# EAGLE design ESP8266_weather_station_v1.1 (EAGLE 9.5.2)
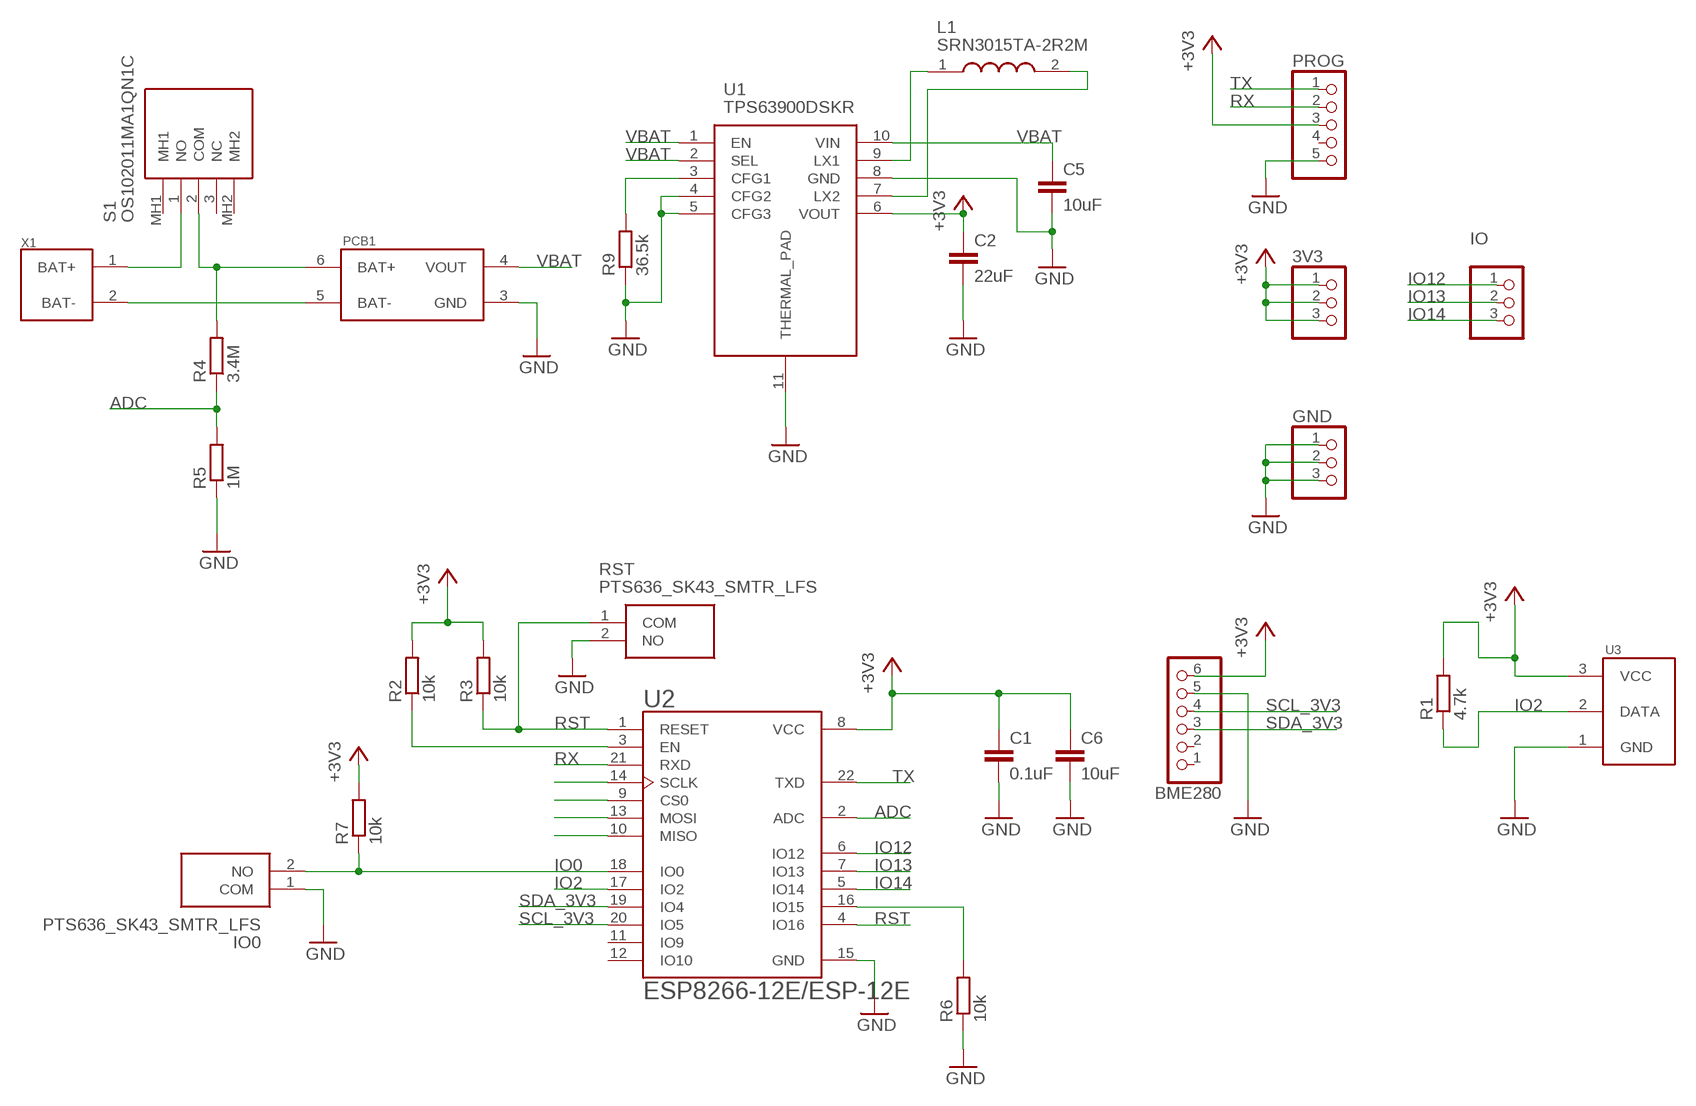
[diagram p0: schematic, sheet 1]

## Parts
3V3  PINHD-1X3  [1X03]
BME280  PINHD-1X6  [1X06]
C1  0.1uF  C-EUC0805  [C0805]
C2  22uF  C-EUC0805  [C0805]
C5  10uF  C-EUC0805  [C0805]
C6  10uF  C-EUC0805  [C0805]
GND  PINHD-1X3  [1X03]
IO  PINHD-1X3  [1X03]
IO0  PTS636_SK43_SMTR_LFS  [PTS636SK43SMTRLFS]
L1  SRN3015TA-2R2M  [SRN3015TA2R2M]
PCB1  TP4056_MODULE  [TP4056_MODULE]
PROG  PINHD-1X5  [1X05]
R1  4.7k  R-EU_R0805  [R0805]
R2  10k  R-EU_R0805  [R0805]
R3  10k  R-EU_R0805  [R0805]
R4  3.4M  R-EU_R0805  [R0805]
R5  1M  R-EU_R0805  [R0805]
R6  10k  R-EU_R0805  [R0805]
R7  10k  R-EU_R0805  [R0805]
R9  36.5k  R-EU_R0805  [R0805]
RST  PTS636_SK43_SMTR_LFS  [PTS636SK43SMTRLFS]
S1  OS102011MA1QN1C  [OS102011MA1QN1C]
U1  TPS63900DSKR  [SON50P250X250X80-11N]
U2  ESP8266-12E/ESP-12E  [XCVR_ESP8266-12E/ESP-12E]
U3  DS18B20  [DS18B20]
X1  18650_SMD_HOLDER  [18650_SMD_HOLDER]

## Nets
+3V3: 3V3.1 3V3.2 3V3.3 BME280.6 C1.1 C2.1 C6.1 PROG.3 R1.2 R2.2 R3.2 R7.2 U1.6(VOUT) U2.8(VCC) U3.3(VCC)
ADC: R4.1 R5.2 U2.2(ADC)
GND: BME280.5 C1.2 C2.2 C5.2 C6.2 GND.1 GND.2 GND.3 IO0.1(COM) PCB1.3(GND) PROG.5 R5.1 R6.1 R9.1 RST.2(NO) U1.4(CFG2) U1.5(CFG3) U1.8(GND) U1.11(THERMAL_PAD) U2.15(GND) U3.1(GND)
IO0: IO0.2(NO) R7.1 U2.18(IO0)
IO2: R1.1 U2.17(IO2) U3.2(DATA)
IO12: IO.1 U2.6(IO12)
IO13: IO.2 U2.7(IO13)
IO14: IO.3 U2.5(IO14)
N$1: S1.1(NO) X1.1(BAT+)
N$3: R9.2 U1.3(CFG1)
N$5: PCB1.6(BAT+) R4.2 S1.2(COM)
N$8: PCB1.5(BAT-) X1.2(BAT-)
N$9: R6.2 U2.16(IO15)
N$10: L1.1 U1.9(LX1)
N$11: L1.2 U1.7(LX2)
N$19: U2.10(MISO)
N$20: U2.13(MOSI)
N$21: U2.9(CS0)
N$22: U2.14(SCLK)
N$24: R2.1 U2.3(EN)
RST: R3.1 RST.1(COM) U2.1(RESET) U2.4(IO16)
RX: PROG.2 U2.21(RXD)
SCL_3V3: BME280.4 U2.20(IO5)
SDA_3V3: BME280.3 U2.19(IO4)
TX: PROG.1 U2.22(TXD)
VBAT: C5.1 PCB1.4(VOUT) U1.1(EN) U1.2(SEL) U1.10(VIN)
Unconnected: BME280.1 BME280.2 PROG.4 S1.3(NC) S1.MH1 S1.MH2 U2.11(IO9) U2.12(IO10)

## Library data of the parts
3V3 GND IO = pinhead:PINHD-1X3: PIN HEADER
BME280 = pinhead:PINHD-1X6: PIN HEADER
C1 C2 C5 C6 = resistor:C-EU: CAPACITOR, European symbol
IO0 RST = SamacSys_Parts:PTS636_SK43_SMTR_LFS: Tactile Switches Tact 50mA 12VDC, 6.0x3.5, 4.3mm H, 250gf, G leads, No ground pin, Black Actuator Source: Datasheet <https://componentsearchengine.com/Datasheets/1/PTS636 SK43 SMTR LFS.pdf>; DESCRIPTION: Tactile Switches Tact 50mA 12VDC, 6.0x3.5, 4.3mm H, 250gf, G leads, No ground pin, Black Actuator; HEIGHT: 4.5mm; MANUFACTURER_NAME: C & K COMPONENTS; MANUFACTURER_PART_NUMBER: PTS636 SK43 SMTR LFS; MOUSER_PART_NUMBER: 611-PTS636SK43SMTRLF; MOUSER_PRICE-STOCK: https://www.mouser.co.uk/ProductDetail/CK/PTS636-SK43-SMTR-LFS?qs=vLWxofP3U2wsQpQ593zsYw%3D%3D
L1 = SamacSys_Parts:SRN3015TA-2R2M: Fixed Inductors 2.2uH 30% 1.7A shdSMD AEC-Q200 Source: Datasheet <https://www.bourns.com/docs/Product-Datasheets/SRN3015TA.pdf>; DESCRIPTION: Fixed Inductors 2.2uH 30% 1.7A shdSMD AEC-Q200; HEIGHT: 1.5mm; MANUFACTURER_NAME: Bourns; MANUFACTURER_PART_NUMBER: SRN3015TA-2R2M; MOUSER_PART_NUMBER: 652-SRN3015TA-2R2M; MOUSER_PRICE-STOCK: https://www.mouser.co.uk/ProductDetail/Bourns/SRN3015TA-2R2M?qs=Vt59ZOdFuWbJCV1ksxH6dQ%3D%3D
PCB1 = custom_components:TP4056_MODULE
PROG = pinhead:PINHD-1X5: PIN HEADER
R1 R4 R5 R9 = resistor:R-EU_: RESISTOR, European symbol
R2 R3 R6 R7 = rcl:R-EU_: RESISTOR, European symbol; SPICEPREFIX: R
S1 = SamacSys_Parts:OS102011MA1QN1C: Switch Slide ON ON SPDT Side Slide 0.1A 12VDC 10000Cycles PC Pins Bracket Mount/Through Hole Bulk Source: Datasheet <https://componentsearchengine.com/Datasheets/1/OS102011MA1QN1C.pdf>; DESCRIPTION: Switch Slide ON ON SPDT Side Slide 0.1A 12VDC 10000Cycles PC Pins Bracket Mount/Through Hole Bulk; HEIGHT: 4.7mm; MANUFACTURER_NAME: C & K COMPONENTS; MANUFACTURER_PART_NUMBER: OS102011MA1QN1C; MOUSER_PART_NUMBER: 611-OS102011MA1QN1C; MOUSER_PRICE-STOCK: https://www.mouser.co.uk/ProductDetail/CK/OS102011MA1QN1C?qs=FZWyocRRknktov%2FYHKgbyA%3D%3D
U1 = SamacSys_Parts:TPS63900DSKR: 1.8-V to 5.5-V, 75-nA IQ Buck-boost Converter with Input Current Limit and DVS Source: Datasheet <https://www.ti.com/lit/gpn/tps63900?HQS=ti-null-null-sf-df-pf-sep-wwe&DCM=yes>; DESCRIPTION: 1.8-V to 5.5-V, 75-nA IQ Buck-boost Converter with Input Current Limit and DVS; HEIGHT: 0.8mm; MANUFACTURER_NAME: Texas Instruments; MANUFACTURER_PART_NUMBER: TPS63900DSKR
U2 = custom_components:ESP8266-12E/ESP-12E: ESP-12E WiFi Module; AVAILABILITY: Unavailable; DESCRIPTION: This WiFi module has a 32-bit MCU micro and clock speeds supporting 80 MHz or 160 MHz. Supports the RTOS and integrated Wi-Fi MAC/BB/RF/PA/LNA, and has an on-board antenna.; MF: AI-Thinker; MP: ESP8266-12E/ESP-12E; PACKAGE: None; PRICE: None
U3 = custom_components:DS18B20
X1 = custom_components:18650_SMD_HOLDER

## Board
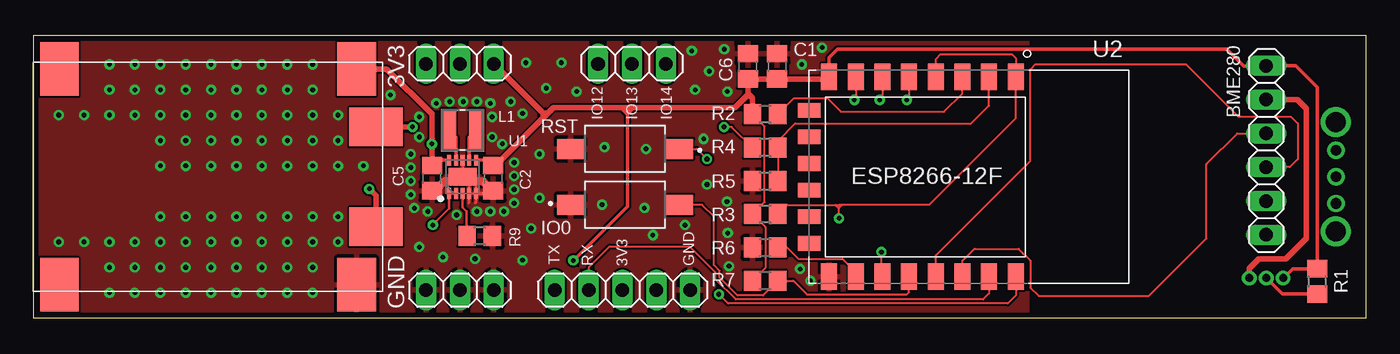
[diagram p1: board, top side]
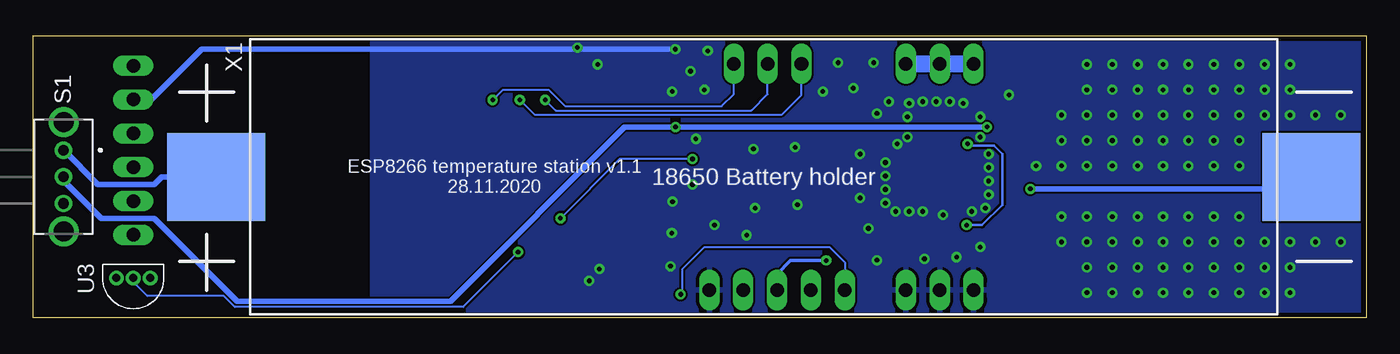
[diagram p2: board, bottom side, seen from below]

Size 100 x 21.2 mm. Coordinates in mm from the lower left corner, seen from the top.
Outline: 0,0 100,0 100,21.2 0,21.2 0,0
Copper layers (1*16): Top 0.035mm / dielectric 1.5mm / Bottom 0.035mm
Design rules "default *": minimum track width 6mil, minimum drill 0.35mm, track to track 6mil, track to pad 6mil, pad to pad 6mil, via to via 6mil, smd to smd 6mil, copper to edge 0.4mm, drill to drill 6mil, minimum pad ring 10mil, minimum via ring 8mil, stop-mask expansion 4mil, vias tented up to drill 15mil, thermal gap 10mil

### Footprints (pad centres in the part's own frame; a part is rotated, then mirrored left to right if it is on the bottom)
1X03 = drill 1.016 long: 1 -2.54,0; 2 0,0; 3 2.54,0
1X06 = drill 1.016 long: 1 -6.35,0; 2 -3.81,0; 3 -1.27,0; 4 1.27,0; 5 3.81,0; 6 6.35,0
C0805 = smd 1.3 x 1.5: 1 -0.95,0; 2 0.95,0
PTS636SK43SMTRLFS = smd 2 x 1.5: 1 -4.1,0; 2 4.1,0
SRN3015TA2R2M = smd 1.1 x 3.2: 1 -1.05,0; 2 1.05,0
TP4056_MODULE = smd 2.9 x 4: 1 -11.15,-8.1; 2 -11.15,8.1; 3 11.15,-8.1; 4 11.15,8.1 | smd 4 x 2.9: 5 12.6,-3.75; 6 12.6,3.75
1X05 = drill 1.016 long: 1 -5.08,0; 2 -2.54,0; 3 0,0; 4 2.54,0; 5 5.08,0
R0805 = smd 1.3 x 1.5: 1 -0.95,0; 2 0.95,0
OS102011MA1QN1C = drill 0.8 pad 1.3: 1 -2.007,-0.025; 2 -0.007,-0.025; 3 1.993,-0.025 | drill 1.5 pad 2.25: MH1 -4.107,-0.025; MH2 4.093,-0.025
SON50P250X250X80-11N = smd 0.8 x 0.3: 1 -1.25,1; 2 -1.25,0.5; 3 -1.25,0; 4 -1.25,-0.5; 5 -1.25,-1; 6 1.25,-1; 7 1.25,-0.5; 8 1.25,0; 9 1.25,0.5; 10 1.25,1 | smd 1.3 x 2.1: 11 0,0
XCVR_ESP8266-12E/ESP-12E = smd 2 x 1.2: 1 -7.5,7; 2 -7.5,5; 3 -7.5,3; 4 -7.5,1; 5 -7.5,-1; 6 -7.5,-3; 7 -7.5,-5; 8 -7.5,-7; 15 7.5,-7; 16 7.5,-5; 17 7.5,-3; 18 7.5,-1; 19 7.5,1; 20 7.5,3; 21 7.5,5; 22 7.5,7 | smd 1.1 x 1.7: 9 -5,-8.5; 10 -3,-8.5; 11 -1,-8.5; 12 1,-8.5; 13 3,-8.5; 14 5,-8.5
DS18B20 = drill 0.6 pad 1: 1 -1.27,0; 2 0,0; 3 1.27,0
18650_SMD_HOLDER = smd 7.34 x 6.6: 1 -41.08,0; 2 41.08,0

### Placement (x,y rotation side)
3V3  32,19.1 0 top
BME280  92.5,12.6 90 top
C1  55.8,18.9 90 top
C2  34.5,10.5 270 top
C5  29.9,10.5 270 top
C6  53.6,18.9 90 top
GND  32,2.1 0 top
IO  44.91,19.1 0 top
IO0  44.4,8.5 0 top
L1  32.2,14.1 0 top
PCB1  13.1,10.6 0 top
PROG  44.2,2.1 0 top
R1  96.32,2.75 90 top
R2  54.9,15.3 180 top
R3  54.9,7.8 180 top
R4  54.9,12.8 180 top
R5  54.9,10.3 0 top
R6  54.9,5.3 0 top
R7  54.9,2.8 180 top
R9  33.5,6.16 180 top
RST  44.4,12.7 180 top
S1  97.7,10.6 270 bottom
U1  32.2,10.6 90 top
U2  66.7,10.6 270 top
U3  92.5,3 180 bottom
X1  45.2,10.6 0 bottom

### Tracks (layer width: path | path; a pad name or v marks a point on that pad's centre or on a via)
+3V3  (via drill 0.35)
  Top 0.152: R7.2 54.91,3.77 54.91,6.83 R3.2 54.86,8.71 54.86,14.39 R2.2
  Top 0.254: U3.3 94.47,3.71 R1.2 96.32,17.35 94.72,18.95 BME280.6 92.47,18.92 90.81,18.92 89.53,20.19 60.33,20.19 59.7,19.57 U2.8 | 44.58,15.29 44.58,15.8 | 44.58,15.29 44.07,15.8 | 44.58,15.29 45.09,15.8 | U1.6 34.1,11.85 C2.1 | v40.51,4.32 44.58,8.38 44.58,15.29
  Top 0.406: 3V3.3 38.25,15.39 | R2.2 53.95,16.54 53.66,16.83 | 53.66,16.83 53.6,16.89 C6.1 C1.1 59.55,17.95 U2.8 | C2.1 34.69,11.45 38.25,15.01 | 38.25,15.01 38.63,15.39 | 38.63,15.39 39.04,15.8 44.07,15.8 44.58,15.8 45.09,15.8 52.63,15.8 53.66,16.83 | 38.25,15.39 38.25,15.01 | 38.25,15.39 38.63,15.39
  Bottom 0.254: v40.51,4.32 43.18,4.32 44.2,3.3 PROG.3
  Bottom 1.27: 3V3.3 3V3.2 3V3.1
ADC
  Top 0.152: U2.2 71.7,15.95 70.36,14.61 57.16,14.61 55.85,13.29 R4.1 R5.2
GND  (via drill 0.35)
  Top 0.203: U1.8 U1.11 32.7,10.1 U1.4 | C2.2 34.3,9.35 | U1.5 U1.4 | U1.5 33.2,10.29 33.15,10.29 | U1.4 32.7,8.7 32.64,8.64 | U1.5 33.2,8.69 33.15,8.64
  Top 0.254: 34.3,9.35 U1.5
  Top 0.406: U3.1 91.23,3.73 91.95,4.45 93.98,4.45 95.5,5.97 95.5,15.75 94.84,16.41 BME280.5
  Top 0.61: C2.2 33.71,10.29 33.15,10.29 32.46,10.34 U1.11 31.89,10.29 30.86,10.29 30.12,9.55 C5.2
  Bottom 0.406: v51.84,20.19 87.38,20.19 91.16,16.41 BME280.5
  other vias: 42.85,12.83 42.67,8.51 36.7,4.34 26.8,16.76 40.77,17.02 38.48,17.27 36.96,19.18 39.62,19.18 49.66,17.14 49.4,20.07 50.7,18.54 52.07,17.02 45.97,12.7 45.85,8.26 46.48,6.22 48.9,6.99 52.2,3.89 52.1,6.38 52.04,8.74 58.29,2.79 57.53,3.68 5.71,19.05 5.71,17.14 5.71,15.24 7.62,15.24 7.62,17.14 7.62,19.05 9.53,19.05 9.53,17.14 9.53,15.24 11.43,15.24 11.43,17.14 11.43,19.05 13.34,19.05 13.34,17.14 13.34,15.24 15.24,15.24 15.24,17.14 15.24,19.05 17.14,19.05 17.14,17.14 17.14,15.24 19.05,15.24 19.05,17.14 19.05,19.05 20.95,19.05 20.95,17.14 20.95,15.24 22.86,15.24 22.86,13.34 20.95,13.34 19.05,13.34 17.14,13.34 15.24,13.34 13.34,13.34 11.43,13.34 9.53,13.34 9.53,11.43 11.43,11.43 13.34,11.43 15.24,11.43 17.14,11.43 19.05,11.43 20.95,11.43 22.86,11.43 22.86,7.62 20.95,7.62 19.05,7.62 17.14,7.62 13.34,7.62 15.24,7.62 11.43,7.62 9.53,7.62 9.53,5.71 11.43,5.71 13.34,5.71 15.24,5.71 17.14,5.71 19.05,5.71 20.95,5.71 22.86,5.71 20.95,3.81 19.05,3.81 17.14,3.81 15.24,3.81 13.34,3.81 11.43,3.81 9.53,3.81 7.62,3.81 5.71,3.81 5.71,5.71 7.62,5.71 3.81,5.71 1.91,5.71 3.81,15.24 1.91,15.24 5.71,1.91 7.62,1.91 9.53,1.91 11.43,1.91 13.34,1.91 15.24,1.91 17.14,1.91 19.05,1.91 20.95,1.91 24.77,11.43 28.32,12.32 28.32,11.3 28.32,10.29 28.32,9.27 28.57,8.26 29.59,8 36.07,8.64 36.07,9.65 36.07,10.67 36.07,11.68 35.18,13.08 34.42,13.59 34.42,15.11 34.29,16.13 33.27,16.26 32.26,16.26 31.24,16.26 30.23,16.13 28.96,15.11 28.96,13.59 31.75,7.75 35.31,8 34.29,8 33.27,8 50.29,13.46 50.55,10.03 57.66,19.05 59.18,20.32 37.97,12.32 37.97,9.02 37.34,6.73 28.96,5.33 30.73,4.57 33.15,4.45 35.81,16.26 36.7,15.37
  pour Top: -1.27,22.86 74.55,22.86 74.55,-1.27 -1.27,-1.27
  pour Bottom: -1.27,22.86 74.55,22.86 74.55,-1.27 -1.27,-1.27
IO0
  Top 0.152: U2.18 65.7,1.95 65.53,1.78 58.04,1.78 57.02,2.8 R7.1 54.75,1.7 52.83,1.7 51.49,3.05 51.49,3.56 51.05,3.99 51.05,7.62 50.17,8.5 IO0.2
IO2  (via drill 0.35)
  Top 0.152: U2.17 63.63,3.17 v63.63,4.95
  Top 0.254: U3.2 93.69,1.8 R1.1
  Bottom 0.152: v63.63,4.95 67.74,0.84 84.89,0.84 85.7,1.65 91.44,1.65 92.5,2.71 U3.2
IO12  (via drill 0.35)
  Top 0.152: U2.6 63.7,16.58 v63.5,16.38
  Bottom 0.152: v63.5,16.38 62.41,15.29 43.81,15.29 42.37,16.74 IO.1
IO13  (via drill 0.35)
  Top 0.152: U2.7 61.7,16.49 v61.59,16.38
  Bottom 0.152: v61.59,16.38 60.81,15.6 46.13,15.6 44.91,16.81 IO.2
IO14  (via drill 0.35)
  Top 0.152: U2.5 65.7,16.55 v65.53,16.38
  Bottom 0.152: v65.53,16.38 64.77,17.14 61.34,17.14 60.1,15.9 48.36,15.9 47.45,16.81 IO.3
N$1
  Bottom 0.406: X1.1 90.36,10.6 90.93,10.03 95.15,10.03 S1.1
N$3
  Top 0.203: U1.3 32.2,8.32 32.51,8.01 32.51,6.2 R9.2
N$5  (via drill 0.35)
  Top 0.152: R4.2 52.4,14.35 v51.82,14.35
  Top 0.406: v28.45,14.35 PCB1.6
  Bottom 0.406: v28.45,14.35 v51.82,14.35 55.63,14.35 68.71,1.27 84.71,1.27 90.93,7.49 94.91,7.49 97.72,10.31 S1.2
N$8  (via drill 0.35)
  Top 0.406: PCB1.5 25.7,9.2 v25.2,9.7
  Bottom 0.406: v25.2,9.7 5.02,9.7 X1.2
N$9
  Top 0.152: R6.2 56.55,5.3 57.4,4.45 60.71,4.45 61.7,3.45 U2.16
N$10
  Top 0.254: U1.9 31.7,13.55 L1.1
N$11
  Top 0.254: U1.7 32.7,13.55 L1.2
N$24
  Top 0.152: R2.1 57.06,16.51 59.56,16.51 60.58,15.49 68.33,15.49 69.7,16.87 U2.3
RST  (via drill 0.35)
  Top 0.152: R3.1 56.56,8.51 60.2,8.51 | 60.2,8.51 60.45,8.51 | U2.4 67.7,19.44 68.07,19.81 73.41,19.81 73.7,19.52 U2.1 73.7,15.03 67.18,8.51 60.71,8.51 | RST.1 49.78,12.7 v50.55,11.94 | v60.45,7.49 60.45,8.26 | 60.45,8.26 60.45,8.51 | 60.2,8.51 60.45,8.26 | 60.71,8.51 60.45,8.51 | 60.71,8.51 60.45,8.26
  Bottom 0.152: v50.55,11.94 56.01,11.94 v60.45,7.49
RX
  Top 0.152: U2.21 71.7,1.85 71.25,1.4 52.7,1.4 51.18,2.92 51.18,3.43 49.28,5.33 43.18,5.33 41.66,3.81 PROG.2
SCL_3V3
  Top 0.152: U2.20 69.7,4.29 70.61,5.21 73.91,5.21 74.8,4.32 74.8,2.29 75.44,1.65 83.69,1.65 88.01,5.97 88.01,11.56 90.32,13.87 BME280.4
SDA_3V3
  Top 0.152: U2.19 67.7,4.71 74.8,11.81 74.8,18.67 75.18,19.05 86.49,19.05 90.42,15.11 94.36,15.11 94.87,14.61 94.87,11.94 94.26,11.33 BME280.3
TX  (via drill 0.35)
  Top 0.152: U2.22 73.7,1.69 73.1,1.09 52.12,1.09 v51.44,1.78
  Bottom 0.152: v51.44,1.78 51.31,1.91 51.31,3.68 49.66,5.33 40.26,5.33 39.12,4.2 PROG.1
VBAT  (via drill 0.35)
  Top 0.203: U1.2 U1.1 31.2,8.21 v29.97,6.99
  Top 0.254: U1.10 30.3,11.85 C5.1
  Top 0.406: PCB1.4 26.51,18.7 29.9,15.31 v29.9,13.08 C5.1
  Bottom 0.203: v29.9,13.08 29.77,12.95 27.94,12.95 27.3,12.32 27.3,8.51 28.83,6.99 v29.97,6.99

### Text on the board
tNames: IO12 | IO13 | IO14 | ESP8266-12F | TX | RX | 3V3 | GND
bNames: ESP8266 temperature station v1.1 / 28.11.2020